# Altium project VoltageImitator_v2.PrjPcb
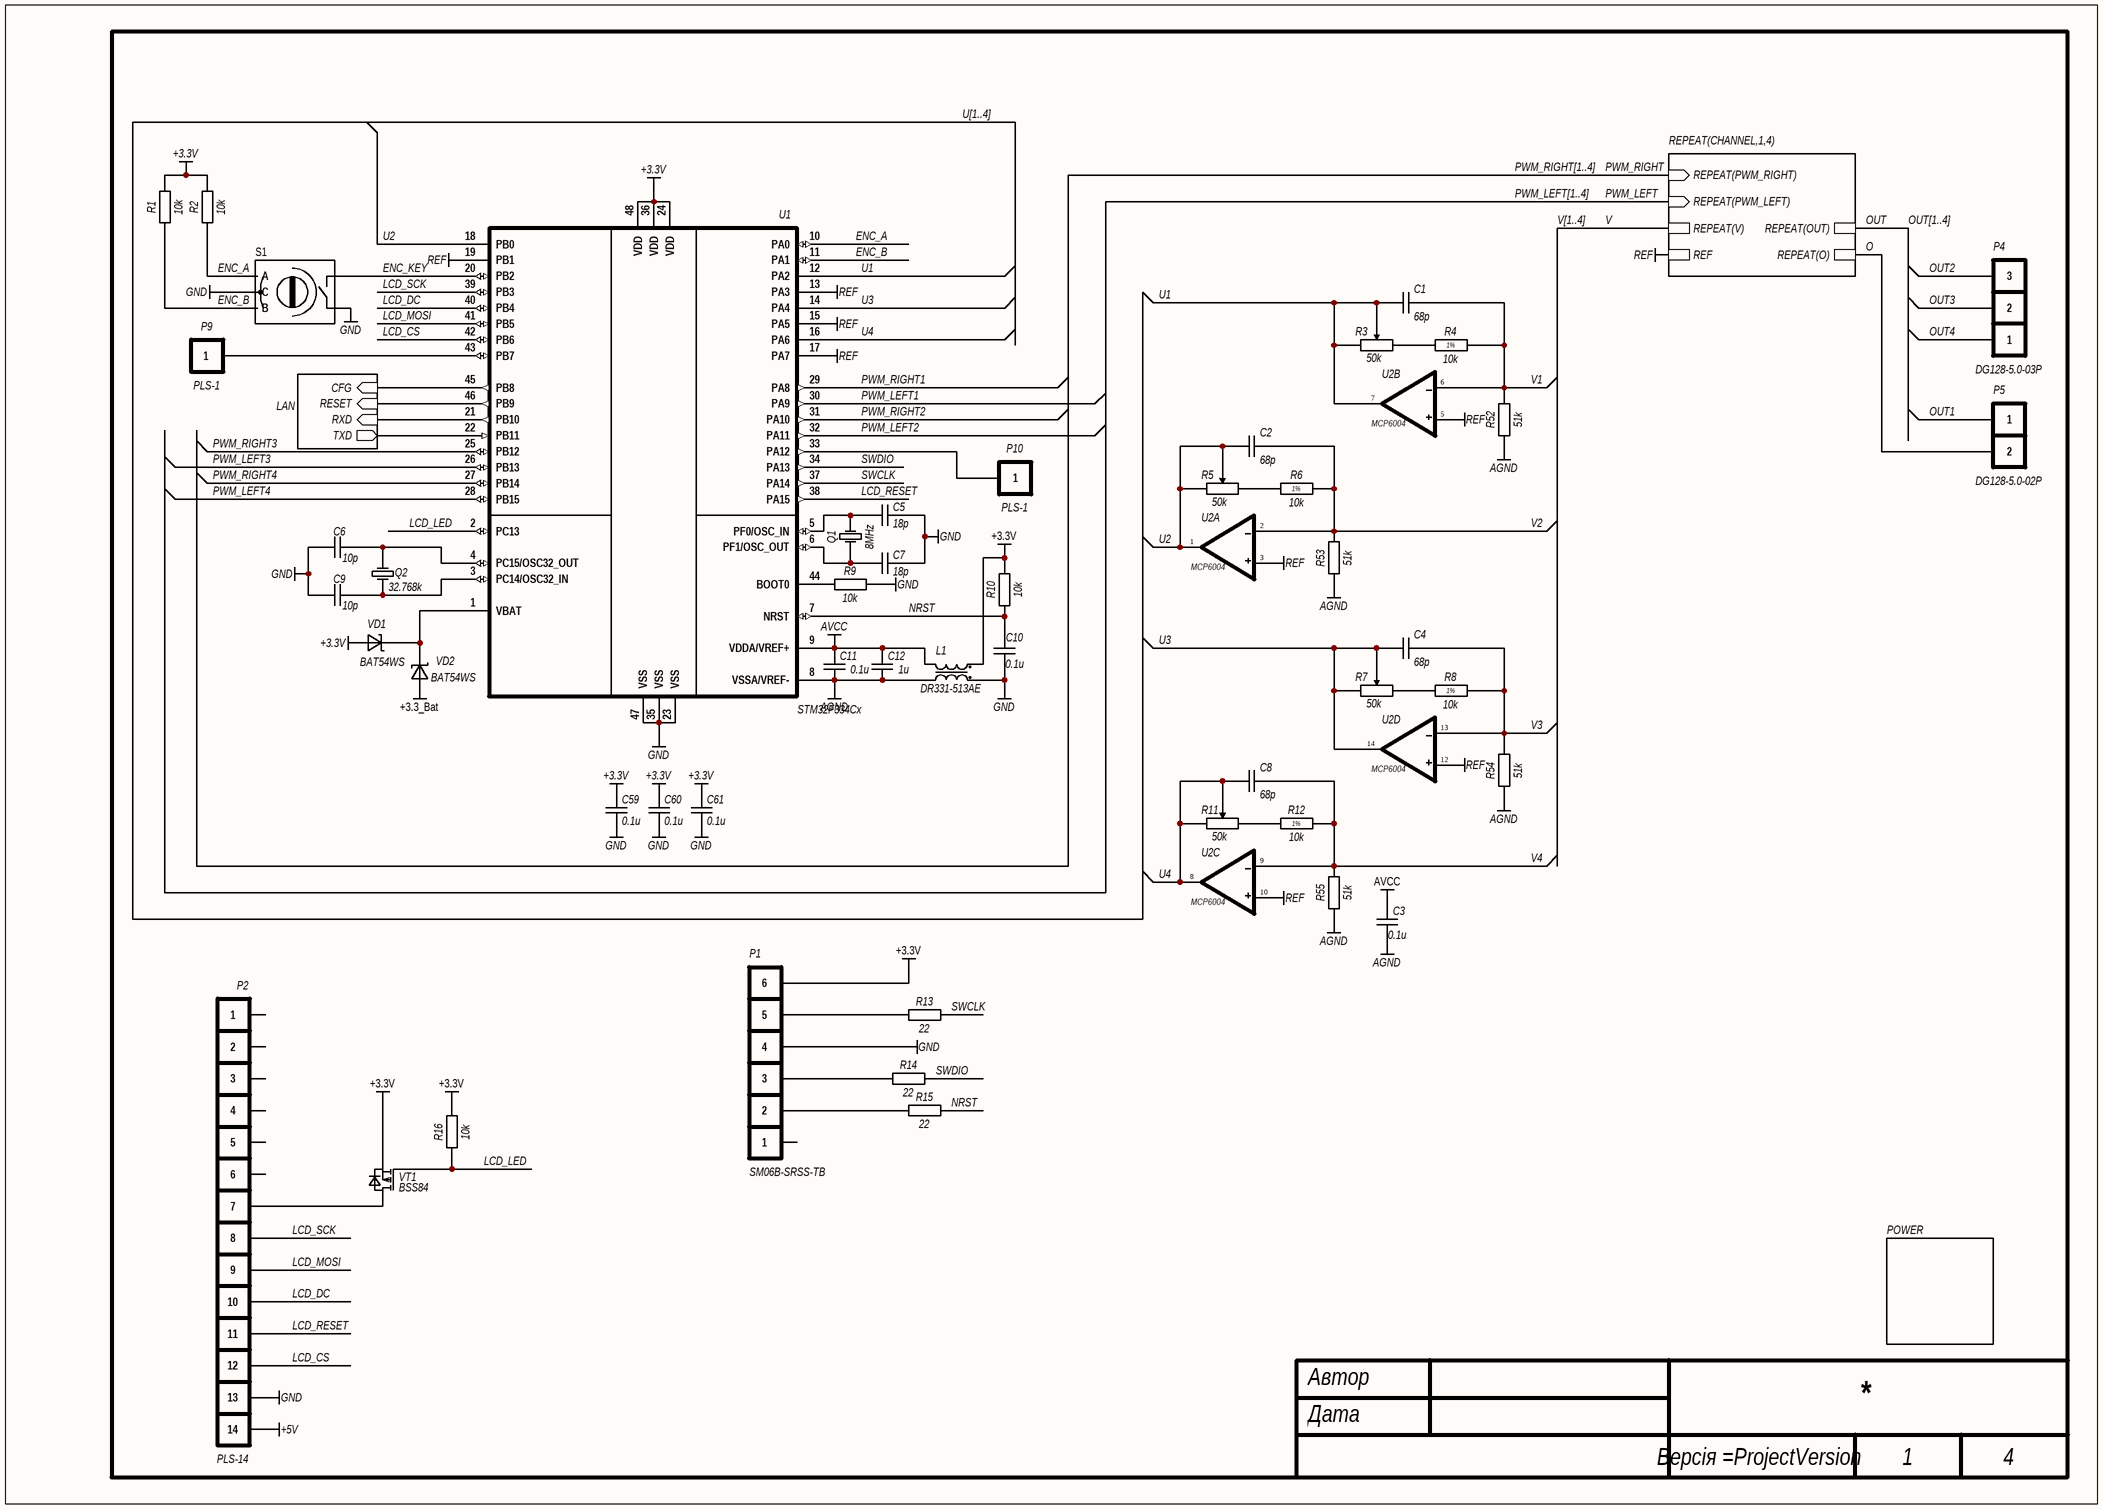
[diagram p0: Main.SchDoc]
ProjectAuthor: Tymokhin Oleksander; ProjectCompanyName: Igor Sikorsky Kyiv Polytechnic Institute; ProjectTitle: Voltage Imitator; ProjectVersion: 1.0
3 sheets, 309 parts. Net scope: hierarchical (ports join the sheet entries above them; power ports are global).
Board file: Board.PcbDoc
Sheets:
  Main.SchDoc
    CHANNEL1 = Channel.SchDoc
    CHANNEL2 = Channel.SchDoc
    CHANNEL3 = Channel.SchDoc
    CHANNEL4 = Channel.SchDoc
    POWER = Power.SchDoc

## Sheet Main.SchDoc
size A3; Author: Tymokhin Oleksander; CompanyName: Igor Sikorsky Kyiv Polytechnic Institute; SheetNumber: 1; SheetTotal: 4; Title1: Voltage Imitator; Version: 1.0

### Parts
C1  68p  [C0603(1608)]
C2  68p  [C0603(1608)]
C3  0.1u  [C0603(1608)]
C4  68p  [C0603(1608)]
C5  18p  [C0603(1608)]
C6  10p  [C0603(1608)]
C7  18p  [C0603(1608)]
C8  68p  [C0603(1608)]
C9  10p  [C0603(1608)]
C10  0.1u  [C0603(1608)]
C11  0.1u  [C0603(1608)]
C12  1u  [C0603(1608)]
C59  0.1u  [C0603(1608)]
C60  0.1u  [C0603(1608)]
C61  0.1u  [C0603(1608)]
L1  DR331-513AE  [DR331]
P1  SM06B-SRSS-TB  [SM06B-SRSS-TB]
P2  PLS-14  [PLS-14]
P4  DG128-5.0-03P  [DG128-5.0-03P]
P5  DG128-5.0-02P  [DG128-5.0-02P]
P9  PLS-1  [PLS-1]
P10  PLS-1  [PLS-1]
Q1  8MHz  [KX-7T]
Q2  32.768k  [KX-327S]
R1  10k  [R0603]
R2  10k  [R0603]
R3  50k  [T910W (3296W)]
R4  10k  Accuracy: 1%  [R0603]
R5  50k  [T910W (3296W)]
R6  10k  Accuracy: 1%  [R0603]
R7  50k  [T910W (3296W)]
R8  10k  Accuracy: 1%  [R0603]
R9  10k  [R0603]
R10  10k  [R0603]
R11  50k  [T910W (3296W)]
R12  10k  Accuracy: 1%  [R0603]
R13  22  [R0603]
R14  22  [R0603]
R15  22  [R0603]
R16  10k  [R0603]
R52  51k  [R0603]
R53  51k  [R0603]
R54  51k  [R0603]
R55  51k  [R0603]
S1  EC12D  [EC12D]  (value not drawn)
U1  STM32F334Сx  [LQFP48]  (value not drawn)
U2  MCP6004  [TSSOP-14]  (parts A,B,C,D of 4)
VD1  BAT54WS  [SOD323]
VD2  BAT54WS  [SOD323]
VT1  BSS84  [SOT23]

### Sub-sheets
LAN = LAN.SchDoc (file not in this document): CFG (in), RESET (in), TXD (out), RXD (in)
POWER = Power.SchDoc: no entries
REPEAT(CHANNEL,1,4) = Channel.SchDoc: REF, REPEAT(V), REPEAT(PWM_LEFT) (in), REPEAT(PWM_RIGHT) (in), REPEAT(OUT), REPEAT(O)

### Nets
+3.3_Bat: VD2.1(A)
+3.3V: C59.2 C60.2 C61.2 L1.2 P1.6 R1.2 R2.2 R10.2 R16.2 U1.24(VDD) U1.36(VDD) U1.48(VDD) VD1.1(A) VT1.2(S)
+5V: P2.14
AGND: C3.1 C11.1 C12.1 L1.4 R52.1 R53.1 R54.1 R55.1 U1.8(VSSA/VREF-) U2.11(V-)
AVCC: C3.2 C11.2 C12.2 L1.3 U1.9(VDDA/VREF+) U2.4(V+)
GND: C5.2 C6.2 C7.2 C9.2 C10.1 C59.1 C60.1 C61.1 L1.1 P1.4 P2.13 R9.2 S1.C S1.E U1.23(VSS) U1.35(VSS) U1.47(VSS)
REF: U1.13(PA3) U1.15(PA5) U1.17(PA7) U1.19(PB1) U2.3(+IN) U2.5(+IN) U2.10(+IN) U2.12(+IN) ; sheet REPEAT(CHANNEL,1,4)/REF
ENC_A: R2.1 S1.A U1.10(PA0)
ENC_B: R1.1 S1.B U1.11(PA1)
ENC_KEY: S1.D U1.20(PB2)
LCD_CS: P2.12 U1.42(PB6)
LCD_DC: P2.10 U1.40(PB4)
LCD_LED: R16.1 U1.2(PC13) VT1.1(G)
LCD_MOSI: P2.9 U1.41(PB5)
LCD_RESET: P2.11 U1.38(PA15)
LCD_SCK: P2.8 U1.39(PB3)
NRST: C10.2 R10.1 R15.2 U1.7(NRST)
O: P5.2 ; sheet REPEAT(CHANNEL,1,4)/REPEAT(O)
OUT: sheet REPEAT(CHANNEL,1,4)/REPEAT(OUT)
OUT1: P5.1
OUT2: P4.3
OUT3: P4.2
OUT4: P4.1
PWM_LEFT: sheet REPEAT(CHANNEL,1,4)/REPEAT(PWM_LEFT)
PWM_LEFT1: U1.30(PA9)
PWM_LEFT2: U1.32(PA11)
PWM_LEFT3: U1.26(PB13)
PWM_LEFT4: U1.28(PB15)
PWM_RIGHT: sheet REPEAT(CHANNEL,1,4)/REPEAT(PWM_RIGHT)
PWM_RIGHT1: U1.29(PA8)
PWM_RIGHT2: U1.31(PA10)
PWM_RIGHT3: U1.25(PB12)
PWM_RIGHT4: U1.27(PB14)
SWCLK: R13.2 U1.37(PA14)
SWDIO: R14.2 U1.34(PA13)
U1: C1.2 R3.2 R3.3 U1.12(PA2) U2.7(OUT)
U2: C2.2 R5.2 R5.3 U1.18(PB0) U2.1(OUT)
U3: C4.2 R7.2 R7.3 U1.14(PA4) U2.14(OUT)
U4: C8.2 R11.2 R11.3 U1.16(PA6) U2.8(OUT)
V: sheet REPEAT(CHANNEL,1,4)/REPEAT(V)
V1: C1.1 R4.1 R52.2 U2.6(-IN)
V2: C2.1 R6.1 R53.2 U2.2(-IN)
V3: C4.1 R8.1 R54.2 U2.13(-IN)
V4: C8.1 R12.1 R55.2 U2.9(-IN)
NetC5_1: C5.1 Q1.1 U1.5(PF0/OSC_IN)
NetC6_1: C6.1 Q2.2 U1.4(PC15/OSC32_OUT)
NetC7_1: C7.1 Q1.2 U1.6(PF1/OSC_OUT)
NetC9_1: C9.1 Q2.1 U1.3(PC14/OSC32_IN)
NetP1_2: P1.2 R15.1
NetP1_3: P1.3 R14.1
NetP1_5: P1.5 R13.1
NetP2_7: P2.7 VT1.3(D)
NetP9_1: P9.1 U1.43(PB7)
NetP10_1: P10.1 U1.33(PA12)
NetR3_1: R3.1 R4.2
NetR5_1: R5.1 R6.2
NetR7_1: R7.1 R8.2
NetR9_1: R9.1 U1.44(BOOT0)
NetR11_1: R11.1 R12.2
NetU1_1: U1.1(VBAT) VD1.2(K) VD2.2(K)
NetU1_21: U1.21(PB10) ; sheet LAN/RXD
NetU1_22: U1.22(PB11) ; sheet LAN/TXD
NetU1_45: U1.45(PB8) ; sheet LAN/CFG
NetU1_46: U1.46(PB9) ; sheet LAN/RESET

Not connected (* = marked no-connect by the designer): P1 1; P2 1 2 3 4 5 6

### Buses and harness runs
bus OUT[1..4]
bus PWM_LEFT[1..4]
bus PWM_RIGHT[1..4]
bus U[1..4]
bus V[1..4]

### Notes on the sheet
- Автор
- Дата

### Library data of the parts
C1-C12 C59-C61 = Capasitor SMD: Model: *
  C1 C2 C4 C8: Value: 68p
  C3 C10 C11 C59-C61: Value: 0.1u
  C5 C7: Value: 18p
  C6 C9: Value: 10p
  C12: Value: 1u
L1 = Chocke Inductor: Model: DR331-513AE
P4 = DG128-5.0-03P: 20A/300V AC 5mm
P5 = DG128-5.0-02P: 20A/300V AC 5mm
Q1 = XTAL: pin to pad: 2>3; Value: 8MHz
Q2 = XTAL: pin to pad: 2>4; Value: 32.768k
R1 R2 R4 R6 R8-R10 R12-R16 R52-R55 = Resistor SMD: Model: *
  R1 R2 R4 R6 R8-R10 R12 R16: Value: 10k
  R13-R15: Value: 22
  R52-R55: Value: 51k
R3 R5 R7 R11 = Trimming Resistor: Set Position: 0.5; Value: 50k
S1 = Encoder with switch
U1 = STM32F334Cx: ARM Cortex-M4 series Microcontroller IC 32-Bit 72MHz 16KB (16K x 8) FLASH 48-LQFP (7x7)
U2 = MCP6004: Low cost, low power, input/output rail-to-rail operational amplifiers. 1.8 - 6V, 1MHz, 100uA
VD1 VD2 = BAT54WS: SOD323 Schottky 30V 230mA
VT1 = BSS84: P-MOS -50V 1.2(10.0)Ω -130(520)mA

## Sheet Channel.SchDoc
size A3; Author: Tymokhin Oleksander; CompanyName: Igor Sikorsky Kyiv Polytechnic Institute; SheetNumber: 2; SheetTotal: 4; Title1: Voltage Imitator; Version: 1.0
Used 4 times, as channels CHANNEL1, CHANNEL2, CHANNEL3, CHANNEL4. Parts and nets are listed once, with the designators drawn on the sheet.
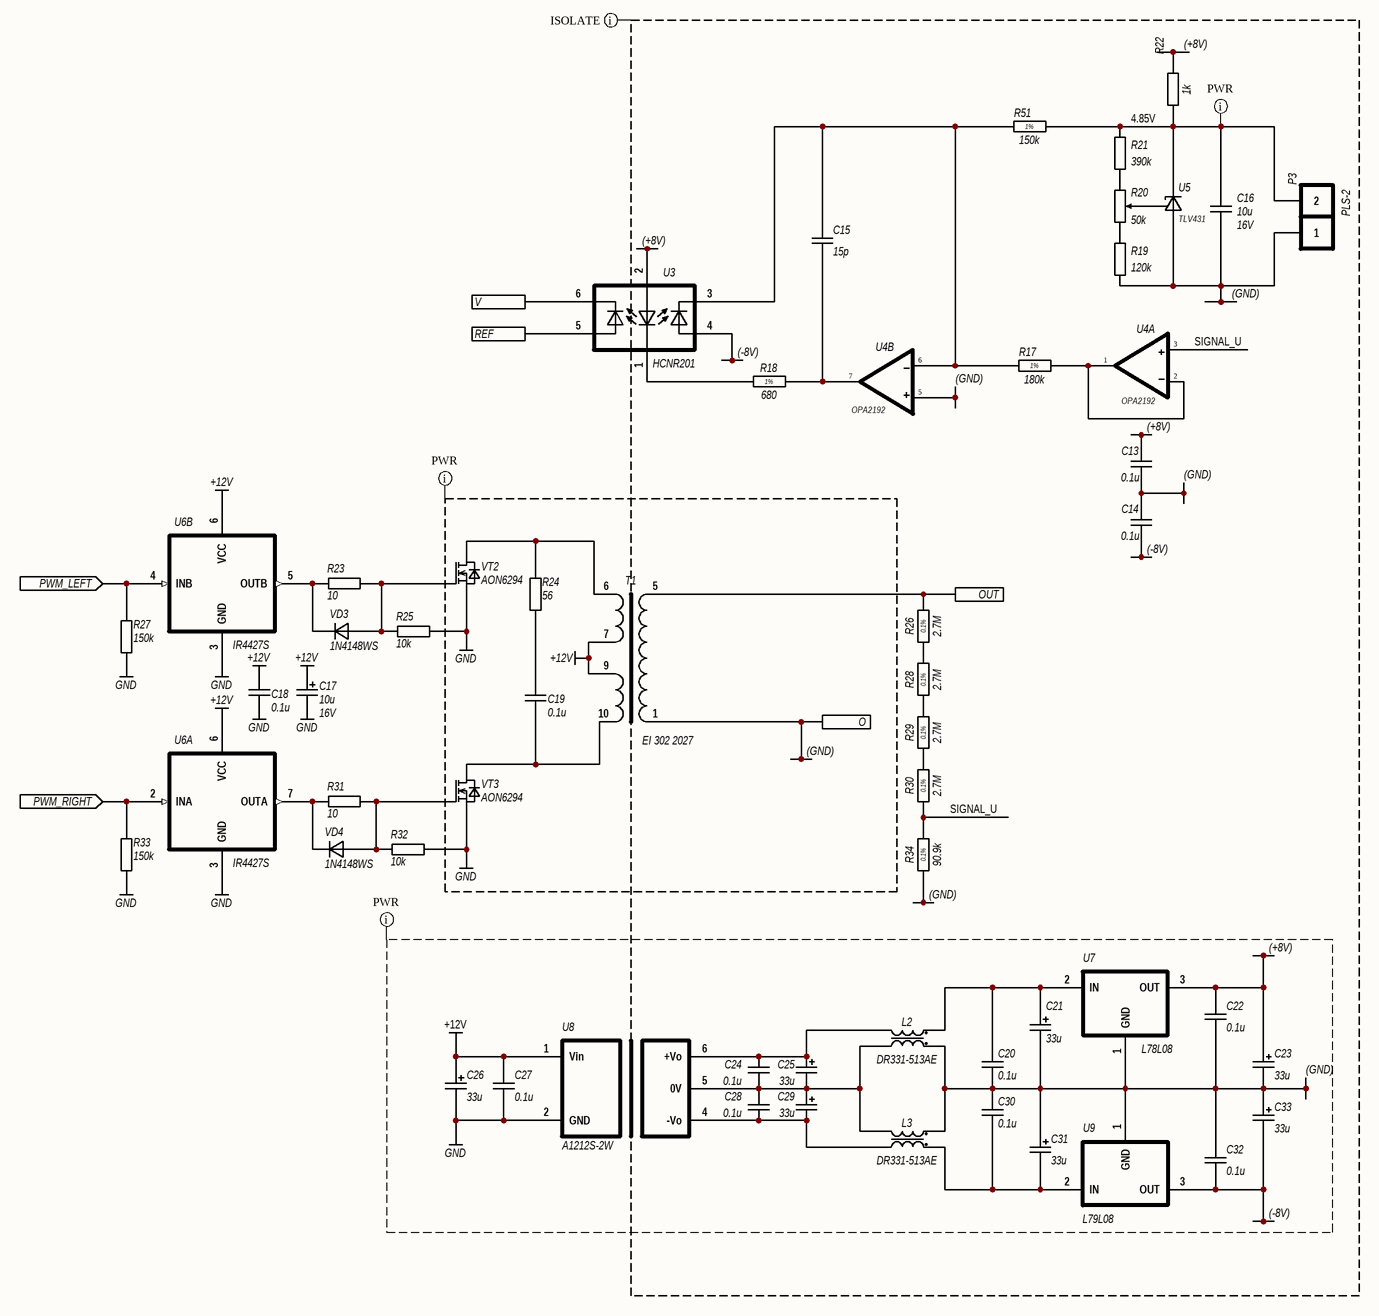
[diagram p1: Channel.SchDoc]

### Parts
C13  0.1u  [C0603(1608)]
C14  0.1u  [C0603(1608)]
C15  15p  [C0603(1608)]
C16  10u  Voltage: 16V  [C0603(1608)]
C17  10u  Voltage: 16V  [EL Case A (3216-18)]
C18  0.1u  [C0603(1608)]
C19  0.1u  [C1206(3216)]
C20  0.1u  [C0603(1608)]
C21  33u  [EL Case A (3216-18)]
C22  0.1u  [C0603(1608)]
C23  33u  [EL Case A (3216-18)]
C24  0.1u  [C0603(1608)]
C25  33u  [EL Case A (3216-18)]
C26  33u  [EL Case A (3216-18)]
C27  0.1u  [C0603(1608)]
C28  0.1u  [C0603(1608)]
C29  33u  [EL Case A (3216-18)]
C30  0.1u  [C0603(1608)]
C31  33u  [EL Case A (3216-18)]
C32  0.1u  [C0603(1608)]
C33  33u  [EL Case A (3216-18)]
L2  DR331-513AE  [DR331]
L3  DR331-513AE  [DR331]
P3  PLS-2  [PLS-2]
R17  180k  Accuracy: 1%  [R0603]
R18  680  Accuracy: 1%  [R1206]
R19  120k  [R0603]
R20  50k  [T910W (3296W)]
R21  390k  [R0603]
R22  1k  [R0603]
R23  10  [R0603]
R24  56  [R2512]
R25  10k  [R0603]
R26  2.7M  Accuracy: 0.1%  [R2512]
R27  150k  [R0603]
R28  2.7M  Accuracy: 0.1%  [R2512]
R29  2.7M  Accuracy: 0.1%  [R2512]
R30  2.7M  Accuracy: 0.1%  [R2512]
R31  10  [R0603]
R32  10k  [R0603]
R33  150k  [R0603]
R34  90.9k  Accuracy: 0.1%  [R2512]
R51  150k  Accuracy: 1%  [R0603]
T1  EI 302 2027  [EI 302 2027]
U3  HCNR201  [HCNR201]
U4  OPA2192  [SO8-150]  (parts A,B of 2)
U5  TLV431  [SOT23]
U6  IR4427S  [SO8-150]  (parts A,B of 2)
U7  L78L08  [SO8-150]
U8  A1212S-2W  [AxxyyS-2W]
U9  L79L08  [SO8-150]
VD3  1N4148WS  [SOD323]
VD4  1N4148WS  [SOD323]
VT2  AON6294  [DFN5x6]
VT3  AON6294  [DFN5x6]

### Ports
O (see Main[8A]), OUT (see Main[8A]), PWM_LEFT (in, see Main[7A]), PWM_RIGHT (in, see Main[7A]), REF (see Main[7A]), V (see Main[7A])

### Nets
+12V: C17.1 C18.1 C26.1 C27.2 T1.7 T1.9 U6.6(VCC) U8.1(Vin)
GND: C17.2 C18.2 C26.2 C27.1 R25.1 R27.2 R32.1 R33.2 U6.3(GND) U8.2(GND) VT2.3(S) VT3.3(S)
V+: U4.8(V+)
V-: U4.4(V-)
(+8V): C13.2 C22.2 C23.1 R22.1 U3.2(LED_ANODE) U7.3(OUT)
(-8V): C14.1 C32.1 C33.2 U3.4(PD1_ANODE) U9.3(OUT)
(GND): C13.1 C14.2 C16.1 C20.1 C21.2 C22.1 C23.2 C30.2 C31.1 C32.2 C33.1 L2.1 L3.2 P3.1 R19.2 R34.1 T1.1 U4.5(+IN) U5.3(A) U7.1(GND) U9.1(GND) ; port O
OUT: R26.2 T1.5 ; port OUT
PWM_LEFT: R27.1 U6.4(INB) ; port PWM_LEFT
PWM_RIGHT: R33.1 U6.2(INA) ; port PWM_RIGHT
REF: U3.5(PD2_ANODE) ; port REF
SIGNAL_U: R30.1 R34.2 U4.3(+IN)
V: U3.6(PD2_CATHODE) ; port V
NetC15_1: C15.1 R18.1 U4.7(OUT)
NetC15_2: C15.2 R17.2 R51.2 U3.3(PD1_CATHODE) U4.6(-IN)
NetC16_2: C16.2 P3.2 R21.1 R22.2 R51.1 U5.2(K)
NetC19_1: C19.1 R24.1
NetC19_2: C19.2 T1.10 VT3.2(D)
NetC20_2: C20.2 C21.1 L2.2 U7.2(IN)
NetC24_1: C24.1 C25.2 C28.2 C29.1 L2.4 L3.3 U8.5(0V)
NetC24_2: C24.2 C25.1 L2.3 U8.6(+Vo)
NetC28_1: C28.1 C29.2 L3.4 U8.4(-Vo)
NetC30_1: C30.1 C31.2 L3.1 U9.2(IN)
NetR17_1: R17.1 U4.1(OUT) U4.2(-IN)
NetR18_2: R18.2 U3.1(LED_CATHODE)
NetR19_1: R19.1 R20.1
NetR20_2: R20.2 U5.1(Adj)
NetR20_3: R20.3 R21.2
NetR23_1: R23.1 U6.5(OUTB) VD3.2(K)
NetR23_2: R23.2 R25.2 VD3.1(A) VT2.1(G)
NetR24_2: R24.2 T1.6 VT2.2(D)
NetR26_1: R26.1 R28.2
NetR28_1: R28.1 R29.2
NetR29_1: R29.1 R30.2
NetR31_1: R31.1 U6.7(OUTA) VD4.2(K)
NetR31_2: R31.2 R32.2 VD4.1(A) VT3.1(G)

### Channels
CHANNEL1: designators end in _CHANNEL1; ports O=(GND)_CHANNEL1 OUT=OUT1 PWM_LEFT=PWM_LEFT1 PWM_RIGHT=PWM_RIGHT1 REF=REF V=V1
CHANNEL2: designators end in _CHANNEL2; ports O=(GND)_CHANNEL2 OUT=OUT2 PWM_LEFT=PWM_LEFT2 PWM_RIGHT=PWM_RIGHT2 REF=REF V=V2
CHANNEL3: designators end in _CHANNEL3; ports O=(GND)_CHANNEL3 OUT=OUT3 PWM_LEFT=PWM_LEFT3 PWM_RIGHT=PWM_RIGHT3 REF=REF V=V3
CHANNEL4: designators end in _CHANNEL4; ports O=(GND)_CHANNEL4 OUT=OUT4 PWM_LEFT=PWM_LEFT4 PWM_RIGHT=PWM_RIGHT4 REF=REF V=V4

### Layout directives
net class PWR: (+8V), (-8V), (GND), +12V, GND, NetC16_CHANNEL1_2
mark named ISOLATE: (+8V), (-8V), (GND), SIGNAL_U

### Notes on the sheet
- 4.85V
- Автор
- Дата

### Library data of the parts
C13-C16 C20 C22 C24 C27 C28 C30 C32 = Capasitor SMD: Model: *
  C13 C14 C20 C22 C24 C27 C28 C30 C32: Value: 0.1u
  C15: Value: 15p
  C16: Value: 10u
C17 = Capasitor TECAP: 10uF 16V Tantalum capasitor in Case-A; Value: 10u
C18 C19 = Capasitor SMD: Multilayer Ceramic Capacitors MLCC - SMD/SMT; Value: 0.1u
C21 C23 C25 C26 C29 C31 C33 = Capasitor TECAP: Model: 293D107X9010D2TE3; Voltage: 6.3V; Value: 33u
L2 L3 = Chocke Inductor: Model: DR331-513AE
R17-R19 R21 R22 R26 R28-R30 R34 R51 = Resistor SMD: Model: *
  R17: Value: 180k
  R18: Value: 680
  R19: Value: 120k; Accuracy: *
  R21: Value: 390k; Accuracy: *
  R22: Value: 1k; Accuracy: *
  R26 R28-R30: Value: 2.7M
  R34: Value: 90.9k
  R51: Value: 150k
R20 = Trimming Resistor: Set Position: 0.5; Value: 50k
R23-R25 R27 R31-R33 = Resistor SMD: Thick Film Resistors - SMD; Model: *
  R23 R31: Value: 10
  R24: Value: 56
  R25 R32: Value: 10k
  R27 R33: Value: 150k
T1 = EI 30
U4 = OPA2192: 36-V, Precision, RRIO, Low Offset Voltage, e-trim Op Amp, 5uV 10MHz 20V/us 1mA
U5 = TLV431: Low Voltage Precision Low noise Variable "Zener". Vin up to 7V, 0.25Ohm output impedance. Sink-current 0.05 - 3mA. Reference voltage - 1.24V
U6 = IR4427S: Dual Low Side Driver
U7 = L78Lxx: pin to pad: 1>2+3+6+7 2>8 3>1
U8 = AxxyyS-1W: In: 12; Power: 2; Out: 12
U9 = L79Lxx: pin to pad: 1>5 2>2+3+6+7 3>1
VD3 VD4 = 1N4148WS: SOD323 100V 200mA
VT2 VT3 = AON6294: N-MOS 100V 10(14)mΩ 33(52)A

## Sheet Power.SchDoc
size A4; Date: 12.10.2021; Author: Tymokhin Oleksander; CompanyName: Igor Sikorsky Kyiv Polytechnic Institute; SheetNumber: 4; SheetTotal: 4; Title1: Voltage Imitator; Title2: - Element supply; Version: 1.0
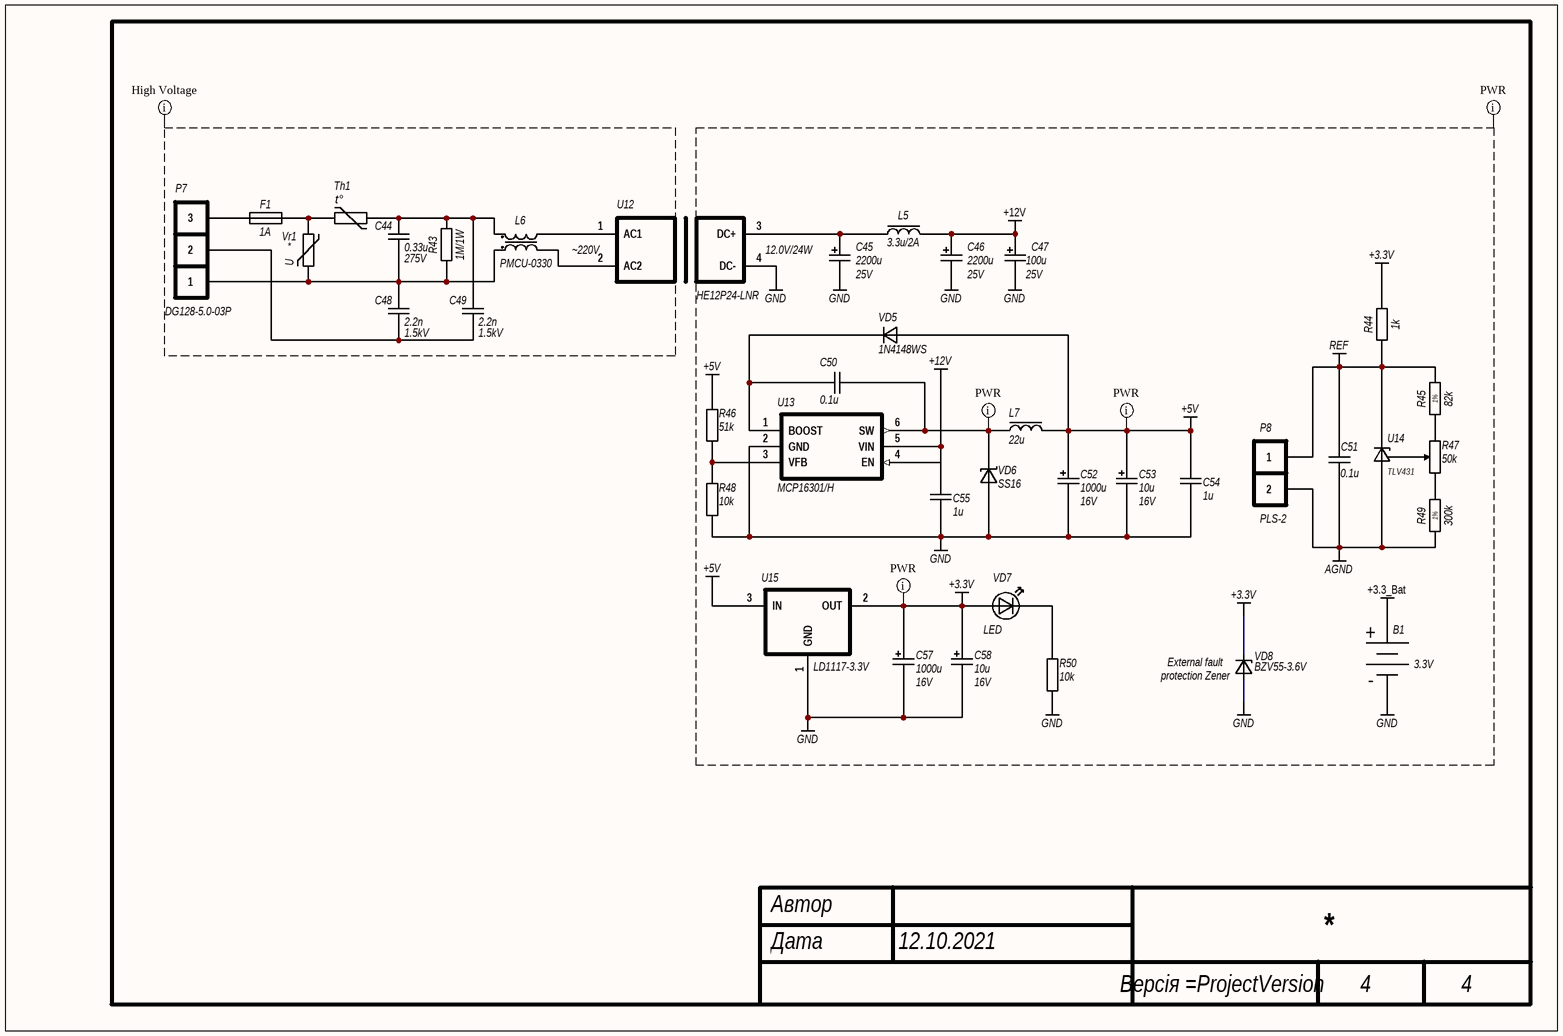
[diagram p2: Power.SchDoc]

### Parts
B1  3.3V  [BH810]
C44  0.33u  Voltage: 275V  [MER 13x5.5 h10 R10.16]
C45  2200u  Voltage: 25V  [El-d13-h25-F5-0.6]
C46  2200u  Voltage: 25V  [El-d13-h25-F5-0.6]
C47  100u  Voltage: 25V  [EL Case A (3216-18)]
C48  2.2n  Voltage: 1.5kV  [MER 13x5.5 h10 R10.16]
C49  2.2n  Voltage: 1.5kV  [MER 13x5.5 h10 R10.16]
C50  0.1u  [C0603(1608)]
C51  0.1u  [C0603(1608)]
C52  1000u  Voltage: 16V  [El-d10-h16-F5-0.6]
C53  10u  Voltage: 16V  [EL Case A (3216-18)]
C54  1u  [C0603(1608)]
C55  1u  [C0603(1608)]
C57  1000u  Voltage: 16V  [El-d10-h16-F5-0.6]
C58  10u  Voltage: 16V  [EL Case A (3216-18)]
F1  1A  [562 Series]
L5  3.3u/2A  [DR-CW8A]
L6  PMCU-0330  [PMCU-0330]
L7  22u  [CDRH6D28]
P7  DG128-5.0-03P  [DG128-5.0-03P]
P8  PLS-2  [PLS-2]
R43  1M/1W  [RES1016-650X250]
R44  1k  [R0603]
R45  82k  Accuracy: 1%  [R0603]
R46  51k  [R0603]
R47  50k  [T910W (3296W)]
R48  10k  [R0603]
R49  300k  Accuracy: 1%  [R0603]
R50  10k  [R0603]
Th1  (no value)  [TH D13 7.5b]
U12  HE12P24-LNR  Out: 12.0V/24W  In: ~220V  [HExxPyy-LRN]
U13  MCP16301/H  [SOT23-6]
U14  TLV431  [SOT23]
U15  LD1117-3.3V  [SOT223]
VD5  1N4148WS  [SOD323]
VD6  SS16  [DO-214AC (SMA)]
VD7  LED  [SMD_0805_GREEN]
VD8  BZV55-3.6V  [SOD80C]
Vr1  *  [VAR-10K-5.6]

### Nets
+3.3_Bat: B1.1
+3.3V: C57.1 C58.1 R44.2 U15.2(OUT) VD7.1(A) VD8.2(K)
+5V: C52.1 C53.1 C54.1 L7.2 R46.2 U15.3(IN) VD5.1(A)
+12V: C46.1 C47.1 C55.1 L5.2 U13.4(EN) U13.5(VIN)
AGND: C51.1 P8.2 R49.1 U14.3(A)
GND: B1.2 C45.2 C46.2 C47.2 C52.2 C53.2 C54.2 C55.2 C57.2 C58.2 R48.1 R50.1 U12.4(DC-) U13.2(GND) U15.1(GND) VD6.1(A) VD8.1(A)
REF: C51.2 P8.1 R44.1 R45.2 U14.2(K)
NetC44_1: C44.1 C48.2 L6.2 P7.1 R43.1 Vr1.1
NetC44_2: C44.2 C49.2 L6.1 R43.2 Th1.2
NetC45_1: C45.1 L5.1 U12.3(DC+)
NetC48_1: C48.1 C49.1 P7.2
NetC50_1: C50.1 U13.1(BOOST) VD5.2(K)
NetC50_2: C50.2 L7.1 U13.6(SW) VD6.2(K)
NetF1_1: F1.1 P7.3
NetF1_2: F1.2 Th1.1 Vr1.2
NetL6_3: L6.3 U12.2(AC2)
NetL6_4: L6.4 U12.1(AC1)
NetR45_1: R45.1 R47.3
NetR46_1: R46.1 R48.2 U13.3(VFB)
NetR47_1: R47.1 R49.2
NetR47_2: R47.2 U14.1(Adj)
NetR50_2: R50.2 VD7.2(K)

### Layout directives
net class PWR: +3.3_Bat, +3.3V, +5V, +12V, AGND, GND, NetC50_2, REF
net class High Voltage: (no net found under the mark)

### Notes on the sheet
- (near VD8) External fault protection Zener
- Автор
- Дата
- (in symbol Battery Holder) +; -
- (in symbol Thermistor) t°
- (in symbol Varistor) U

### Library data of the parts
B1 = Battery Holder: Battery holder CR2032 (3.3В); Value: 3.3V
C44 C48 C49 = Capasitor: Model: *
  C44: Value: 0.33u
  C48 C49: Value: 2.2n
C45 C46 = Capasitor POL: Model: ECAP 2200/6.3V 1020 105'C; Value: 2200u
C47 = Capasitor TECAP: Model: 293D227X96R3C2TE3; Value: 100u
C50 C51 C54 C55 = Capasitor SMD
  C50: Value: 0.1u
  C51: Value: 0.1u; Model: *
  C54 C55: Value: 1u
C52 C57 = Capasitor POL: Model: ECAP 1000/16V 1016 105°C; Value: 1000u
C53 C58 = Capasitor TECAP: Model: TAJA106K016RNJ; Value: 10u
F1 = Fuse: Value: 1A; Model: *
L5 L7 = Inductor
  L5: Value: 3.3u/2A
  L7: Value: 22u
L6 = Chocke Inductor
P7 = DG128-5.0-03P: 20A/300V AC 5mm
R43 = Resistor THD: Value: 1M/1W; Model: *
R44-R46 R48-R50 = Resistor SMD: Model: *
  R44: Value: 1k; Accuracy: *
  R45: Value: 82k
  R46: Value: 51k
  R48 R50: Value: 10k
  R49: Value: 300k
R47 = Trimming Resistor: Set Position: 0.5; Value: 50k
Th1 = Thermistor
U14 = TLV431: as U5 on sheet Channel
U15 = LD1117: pin to pad: 2>2+4; Value: 3.3V
VD5 = 1N4148WS: SOD323 100V 200mA
VD6 = SS16: SMA (DO214AC) Schottky 60V 1A
VD8 = BZV55: SOD80C 250mA; Voltage: 3.6V
Vr1 = Varistor: Model: *
VD7 = LED: Model: *

## Nets that join several sheets
+3.3_Bat: Main (VD2.1), Power (B1.1)
+3.3V: Main (14 pins), Power (6 pins)
+5V: Main (P2.14), Power (7 pins)
+12V: CHANNEL1 (8 pins), CHANNEL2 (8 pins), CHANNEL3 (8 pins), CHANNEL4 (8 pins), Power (6 pins)
AGND: Main (10 pins), Power (C51.1 P8.2 R49.1 U14.3)
GND: Main (17 pins), CHANNEL1 (12 pins), CHANNEL2 (12 pins), CHANNEL3 (12 pins), CHANNEL4 (12 pins), Power (17 pins)
REF: Main (8 pins), CHANNEL1 (U3_CHANNEL1.5), CHANNEL2 (U3_CHANNEL2.5), CHANNEL3 (U3_CHANNEL3.5), CHANNEL4 (U3_CHANNEL4.5), Power (5 pins)
V+: CHANNEL1 (U4_CHANNEL1.8), CHANNEL2 (U4_CHANNEL2.8), CHANNEL3 (U4_CHANNEL3.8), CHANNEL4 (U4_CHANNEL4.8)
V-: CHANNEL1 (U4_CHANNEL1.4), CHANNEL2 (U4_CHANNEL2.4), CHANNEL3 (U4_CHANNEL3.4), CHANNEL4 (U4_CHANNEL4.4)
OUT1: Main (P5.1), CHANNEL1 (R26_CHANNEL1.2 T1_CHANNEL1.5)
OUT2: Main (P4.3), CHANNEL2 (R26_CHANNEL2.2 T1_CHANNEL2.5)
OUT3: Main (P4.2), CHANNEL3 (R26_CHANNEL3.2 T1_CHANNEL3.5)
OUT4: Main (P4.1), CHANNEL4 (R26_CHANNEL4.2 T1_CHANNEL4.5)
PWM_LEFT1: Main (U1.30), CHANNEL1 (R27_CHANNEL1.1 U6_CHANNEL1.4)
PWM_LEFT2: Main (U1.32), CHANNEL2 (R27_CHANNEL2.1 U6_CHANNEL2.4)
PWM_LEFT3: Main (U1.26), CHANNEL3 (R27_CHANNEL3.1 U6_CHANNEL3.4)
PWM_LEFT4: Main (U1.28), CHANNEL4 (R27_CHANNEL4.1 U6_CHANNEL4.4)
PWM_RIGHT1: Main (U1.29), CHANNEL1 (R33_CHANNEL1.1 U6_CHANNEL1.2)
PWM_RIGHT2: Main (U1.31), CHANNEL2 (R33_CHANNEL2.1 U6_CHANNEL2.2)
PWM_RIGHT3: Main (U1.25), CHANNEL3 (R33_CHANNEL3.1 U6_CHANNEL3.2)
PWM_RIGHT4: Main (U1.27), CHANNEL4 (R33_CHANNEL4.1 U6_CHANNEL4.2)
V1: Main (C1.1 R4.1 R52.2 U2.6), CHANNEL1 (U3_CHANNEL1.6)
V2: Main (C2.1 R6.1 R53.2 U2.2), CHANNEL2 (U3_CHANNEL2.6)
V3: Main (C4.1 R8.1 R54.2 U2.13), CHANNEL3 (U3_CHANNEL3.6)
V4: Main (C8.1 R12.1 R55.2 U2.9), CHANNEL4 (U3_CHANNEL4.6)